# Altium schematic sheet imu_ism330.SchDoc
size A
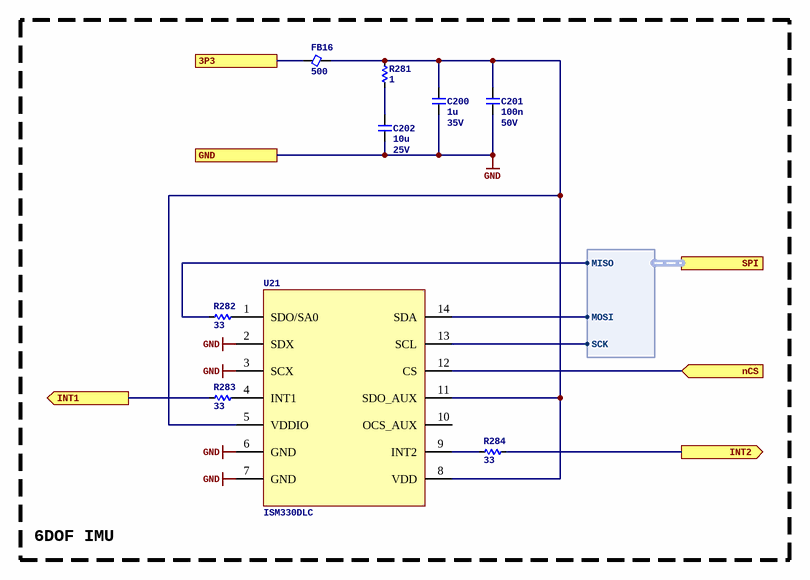
[diagram p0: imu_ism330.SchDoc]

## Parts
C200  Capacitance: 1u  Voltage Rating: 35V  [C0603]  (hidden comment: GMK107AB7105KAHT)
C201  Capacitance: 100n  Voltage Rating: 50V  [C0402]  (hidden comment: CL05B104KB54PNC)
C202  Capacitance: 10u  Voltage Rating: 25V  [C0805]  (hidden comment: CL21B106KAYQNNE)
FB16  Current Rating (mA): 500  [FB0402]  (hidden comment: BLM15AX601SN1D)
R281  value 1  [R0402]  (hidden comment: CRCW04021R00FKED)
R282  value 33  [R0402]  (hidden comment: 0402WGF330JTCE)
R283  value 33  [R0402]  (hidden comment: 0402WGF330JTCE)
R284  value 33  [R0402]  (hidden comment: 0402WGF330JTCE)
U21  ISM330DLC  [ST_LGA-14L]

## Blocks framed on the sheet
6DOF IMU: C200-C202 FB16 R281-R284 U21

## Ports
3P3, GND, INT1 (out), INT2 (out), nCS (in), SPI (harness SPI)

## Harnesses
SPI: MISO, MOSI, SCK

## Nets
GND: C200.2 C201.2 C202.2 U21.2(SDX) U21.3(SCX) U21.6(GND) U21.7(GND) ; port GND
3P3: FB16.1 ; port 3P3
INT1: R283.1 ; port INT1
INT2: R284.2 ; port INT2
nCS: U21.12(CS) ; port nCS
NetC200_1: C200.1 C201.1 FB16.2 R281.2 U21.5(VDDIO) U21.8(VDD) U21.11(SDO_AUX)
NetC202_1: C202.1 R281.1
NetR282_1: R282.1 ; port SPI.MISO
NetR282_2: R282.2 U21.1(SDO/SA0)
NetR283_2: R283.2 U21.4(INT1)
NetR284_1: R284.1 U21.9(INT2)
NetU21_13: U21.13(SCL) ; port SPI.SCK
NetU21_14: U21.14(SDA) ; port SPI.MOSI

Not connected (* = marked no-connect by the designer): U21 10(OCS_AUX)

## Library data of the parts
C200 = GMK107AB7105KAHT: Manufacturer: Taiyo Yuden; Dielectric: X7R; ComponentLink1URL: https://datasheet.lcsc.com/lcsc/2304140030_Taiyo-Yuden-GMK107AB7105KAHT_C841050.pdf; ComponentLink1Description: Datasheet; Manufacturer Part Number: GMK107AB7105KAHT; Package: 0603; Supplier 2: LCSC; Supplier Part Number 2: C841050
C201 = CL05B104KB54PNC: Manufacturer: Samsung Electro-Mechanics; Dielectric: X7R; ComponentLink1URL: https://wmsc.lcsc.com/wmsc/upload/file/pdf/v2/lcsc/2304140030_Samsung-Electro-Mechanics-CL05B104KB54PNC_C307331.pdf; ComponentLink1Description: Datasheet; Manufacturer Part Number: CL05B104KB54PNC; Package: 0402; Supplier 2: LCSC; Supplier Part Number 2: C307331
C202 = CL21B106KAYQNNE: Manufacturer: Samsung Electro-Mechanics; Dielectric: X7R; ComponentLink1URL: https://datasheet.lcsc.com/lcsc/2206222030_Samsung-Electro-Mechanics-CL21B106KAYQNNE_C3039694.pdf; ComponentLink1Description: Datasheet; Manufacturer Part Number: CL21B106KAYQNNE; Package: 0805; Supplier 2: LCSC; Supplier Part Number 2: C3039694
FB16 = BLM15AX601SN1D: Manufacturer: Murata Electronics; Z @ 100 MHz: 600; DCR (mOhms): 340; ComponentLink1URL: https://wmsc.lcsc.com/wmsc/upload/file/pdf/v2/lcsc/2304140030_Murata-Electronics-BLM15AX601SN1D_C76886.pdf; ComponentLink1Description: Datasheet; Manufacturer Part Number: BLM15AX601SN1D; Package: 0402; Supplier 2: LCSC; Supplier Part Number 2: C76886
R281 = CRCW04021R00FKED: Manufacturer: Vishay Intertech; Tolerance: 1%; Temperature Coefficient: Â±100ppm/â„ƒ; Power Rating (mW): 63; ComponentLink1Description: Datasheet; ComponentLink1URL: https://wmsc.lcsc.com/wmsc/upload/file/pdf/v2/lcsc/2211030200_Vishay-Intertech-CRCW04021R00FKED_C482087.pdf; Manufacturer Part Number: CRCW04021R00FKED; Package: 0402; Supplier 2: LCSC; Supplier Part Number 2: C482087
R282-R284 = 0402WGF330JTCE: Manufacturer: UNI-ROYAL(Uniroyal Elec); Tolerance: 1%; Temperature Coefficient: Â±100ppm/â„ƒ; Power Rating (mW): 62.5; ComponentLink1Description: Datasheet; ComponentLink1URL: https://wmsc.lcsc.com/wmsc/upload/file/pdf/v2/lcsc/2205311900_UNI-ROYAL-Uniroyal-Elec-0402WGF330JTCE_C25105.pdf; Manufacturer Part Number: 0402WGF330JTCE; Package: 0402; Supplier 2: LCSC; Supplier Part Number 2: C25105
U21 = IMU_ISM330DLC: ST ACCELEROMETER/GYROSCOPE 3D 14LGA LOW POWER; Manufacturer: ST Microelectronics; Supplier 1: Digi-Key; Supplier Part Number 1: 497-17583-6-ND; ComponentLink1Description: Datasheet; ComponentLink1URL: https://www.st.com/resource/en/datasheet/ism330dlc.pdf; Manufacturer Part Number: ISM330DLC; Supplier 2: LCSC; Supplier Part Number 2: C2943126